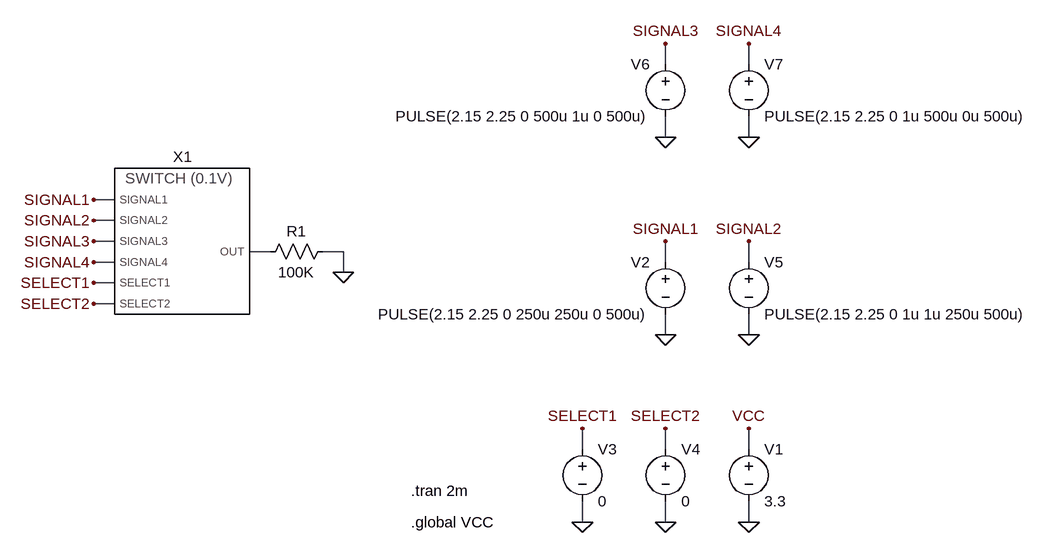
[diagram p0: schematic test_switch4_0.1v.asc]
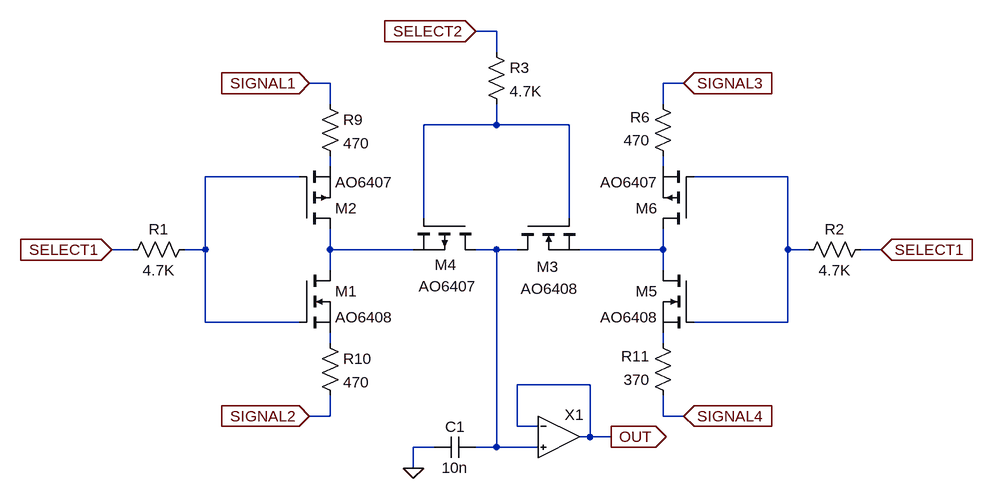
[diagram p1: sub-circuit switch4_0.1v.asc]
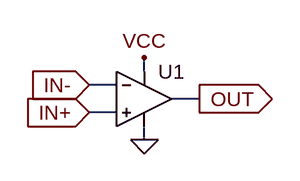
[diagram p2: sub-circuit opamp.asc]
test_switch4_0.1v.asc, the LTspice schematic file:
Version 4
SHEET 1 1908 768
WIRE 896 -64 896 -96
WIRE 1024 -64 1024 -96
WIRE 896 48 896 16
WIRE 1024 48 1024 16
WIRE 48 144 16 144
WIRE 48 176 16 176
WIRE 48 208 16 208
WIRE 288 224 256 224
WIRE 400 224 368 224
WIRE 48 240 16 240
WIRE 896 240 896 208
WIRE 1024 240 1024 208
WIRE 400 256 400 224
WIRE 48 272 16 272
WIRE 48 304 16 304
WIRE 896 352 896 320
WIRE 1024 352 1024 320
WIRE 768 528 768 496
WIRE 896 528 896 496
WIRE 1024 528 1024 496
WIRE 768 640 768 608
WIRE 896 640 896 608
WIRE 1024 640 1024 608
FLAG 400 256 0
FLAG 1024 640 0
FLAG 1024 496 VCC
FLAG 896 352 0
FLAG 896 208 SIGNAL1
FLAG 16 144 SIGNAL1
FLAG 16 176 SIGNAL2
FLAG 16 208 SIGNAL3
FLAG 16 240 SIGNAL4
FLAG 768 640 0
FLAG 768 496 SELECT1
FLAG 896 640 0
FLAG 896 496 SELECT2
FLAG 16 272 SELECT1
FLAG 16 304 SELECT2
FLAG 1024 352 0
FLAG 1024 208 SIGNAL2
FLAG 896 48 0
FLAG 896 -96 SIGNAL3
FLAG 1024 48 0
FLAG 1024 -96 SIGNAL4
SYMBOL res 384 208 R90
WINDOW 0 0 56 VBottom 2
WINDOW 3 32 56 VTop 2
SYMATTR InstName R1
SYMATTR Value 100K
SYMBOL voltage 1024 512 R0
WINDOW 123 0 0 Left 0
WINDOW 39 0 0 Left 0
SYMATTR InstName V1
SYMATTR Value 3.3
SYMBOL voltage 896 224 M0
WINDOW 123 0 0 Left 0
WINDOW 39 0 0 Left 0
SYMATTR InstName V2
SYMATTR Value PULSE(2.15 2.25 0 250u 250u 0 500u)
SYMBOL voltage 768 512 R0
WINDOW 123 0 0 Left 0
WINDOW 39 0 0 Left 0
SYMATTR InstName V3
SYMATTR Value 0
SYMBOL voltage 896 512 R0
WINDOW 123 0 0 Left 0
WINDOW 39 0 0 Left 0
SYMATTR InstName V4
SYMATTR Value 0
SYMBOL voltage 1024 224 R0
WINDOW 123 0 0 Left 0
WINDOW 39 0 0 Left 0
SYMATTR InstName V5
SYMATTR Value PULSE(2.15 2.25 0 1u 1u 250u 500u)
SYMBOL voltage 896 -80 M0
WINDOW 123 0 0 Left 0
WINDOW 39 0 0 Left 0
SYMATTR InstName V6
SYMATTR Value PULSE(2.15 2.25 0 500u 1u 0 500u)
SYMBOL voltage 1024 -80 R0
WINDOW 123 0 0 Left 0
WINDOW 39 0 0 Left 0
SYMATTR InstName V7
SYMATTR Value PULSE(2.15 2.25 0 1u 500u 0u 500u)
SYMBOL switch4_0.1v 80 144 R0
SYMATTR InstName X1
TEXT 504 592 Left 2 !.tran 2m
TEXT 504 640 Left 2 !.global VCC

switch4_0.1v.asc, the sub-circuit schematic file:
Version 4
SHEET 1 1676 680
WIRE 848 -144 816 -144
WIRE 848 -112 848 -144
WIRE 592 -64 560 -64
WIRE 1136 -64 1104 -64
WIRE 592 -32 592 -64
WIRE 1104 -32 1104 -64
WIRE 848 0 848 -32
WIRE 848 0 736 0
WIRE 960 0 848 0
WIRE 592 64 592 48
WIRE 1104 64 1104 48
WIRE 544 80 400 80
WIRE 1296 80 1152 80
WIRE 736 144 736 0
WIRE 960 144 960 0
WIRE 288 192 256 192
WIRE 400 192 400 80
WIRE 400 192 368 192
WIRE 592 192 592 160
WIRE 720 192 592 192
WIRE 848 192 816 192
WIRE 880 192 848 192
WIRE 1104 192 1104 160
WIRE 1104 192 976 192
WIRE 1296 192 1296 80
WIRE 1328 192 1296 192
WIRE 1440 192 1408 192
WIRE 592 224 592 192
WIRE 1104 224 1104 192
WIRE 400 304 400 192
WIRE 544 304 400 304
WIRE 1296 304 1296 192
WIRE 1296 304 1152 304
WIRE 592 336 592 320
WIRE 1104 336 1104 320
WIRE 992 400 880 400
WIRE 592 448 592 416
WIRE 592 448 560 448
WIRE 1104 448 1104 416
WIRE 1136 448 1104 448
WIRE 880 464 880 400
WIRE 912 464 880 464
WIRE 992 480 992 400
WIRE 992 480 976 480
WIRE 1024 480 992 480
WIRE 752 496 720 496
WIRE 848 496 848 192
WIRE 848 496 816 496
WIRE 912 496 848 496
WIRE 720 528 720 496
FLAG 560 -64 SIGNAL1
IOPIN 560 -64 In
FLAG 560 448 SIGNAL2
IOPIN 560 448 In
FLAG 256 192 SELECT1
IOPIN 256 192 In
FLAG 816 -144 SELECT2
IOPIN 816 -144 In
FLAG 1024 480 OUT
IOPIN 1024 480 Out
FLAG 720 528 0
FLAG 1136 -64 SIGNAL3
IOPIN 1136 -64 In
FLAG 1136 448 SIGNAL4
IOPIN 1136 448 In
FLAG 1440 192 SELECT1
IOPIN 1440 192 In
SYMBOL nmos 544 224 R0
SYMATTR InstName M1
SYMATTR Value AO6408
SYMBOL pmos 544 160 M180
SYMATTR InstName M2
SYMATTR Value AO6407
SYMBOL cap 816 480 R90
WINDOW 0 0 32 VBottom 2
WINDOW 3 32 32 VTop 2
SYMATTR InstName C1
SYMATTR Value 10n
SYMBOL res 576 -48 R0
SYMATTR InstName R9
SYMATTR Value 470
SYMBOL res 576 320 R0
SYMATTR InstName R10
SYMATTR Value 470
SYMBOL pmos 816 144 R90
WINDOW 0 71 63 VLeft 2
WINDOW 3 104 88 VLeft 2
SYMATTR InstName M4
SYMATTR Value AO6407
SYMBOL nmos 880 144 M90
WINDOW 0 74 30 VRight 2
WINDOW 3 108 5 VRight 2
SYMATTR InstName M3
SYMATTR Value AO6408
SYMBOL nmos 1152 224 M0
SYMATTR InstName M5
SYMATTR Value AO6408
SYMBOL pmos 1152 160 R180
SYMATTR InstName M6
SYMATTR Value AO6407
SYMBOL res 1120 64 R180
WINDOW 0 36 76 Left 2
WINDOW 3 36 40 Left 2
SYMATTR InstName R6
SYMATTR Value 470
SYMBOL res 1120 432 R180
WINDOW 0 36 76 Left 2
WINDOW 3 36 40 Left 2
SYMATTR InstName R11
SYMATTR Value 370
SYMBOL opamp 944 480 R0
WINDOW 0 9 -34 Left 2
SYMATTR InstName X1
SYMBOL res 384 176 R90
WINDOW 0 0 56 VBottom 2
WINDOW 3 32 56 VTop 2
SYMATTR InstName R1
SYMATTR Value 4.7K
SYMBOL res 1424 176 R90
WINDOW 0 0 56 VBottom 2
WINDOW 3 32 56 VTop 2
SYMATTR InstName R2
SYMATTR Value 4.7K
SYMBOL res 832 -128 R0
SYMATTR InstName R3
SYMATTR Value 4.7K

opamp.asc, the sub-circuit schematic file:
Version 4
SHEET 1 880 680
WIRE 144 144 144 128
WIRE 112 160 80 160
WIRE 208 176 176 176
WIRE 112 192 80 192
WIRE 144 224 144 208
FLAG 144 224 0
FLAG 144 128 VCC
FLAG 208 176 OUT
IOPIN 208 176 Out
FLAG 80 192 IN+
IOPIN 80 192 In
FLAG 80 160 IN-
IOPIN 80 160 In
SYMBOL Opamps\\UniversalOpamp2 144 176 R0
SYMATTR InstName U1
SYMATTR Value2 Avol=1Meg GBW=1.2Meg Slew=10Meg

The netlist it stands for:
* test_switch4_0.1v.asc
R1 0 N001 100K
V1 VCC 0 3.3
V2 SIGNAL1 0 PULSE(2.15 2.25 0 250u 250u 0 500u)
V3 SELECT1 0 0
V4 SELECT2 0 0
V5 SIGNAL2 0 PULSE(2.15 2.25 0 1u 1u 250u 500u)
V6 SIGNAL3 0 PULSE(2.15 2.25 0 500u 1u 0 500u)
V7 SIGNAL4 0 PULSE(2.15 2.25 0 1u 500u 0u 500u)
XX1 SELECT1 SIGNAL1 SIGNAL2 N001 SIGNAL3 SIGNAL4 SELECT2 switch4_0.1v

* block symbol definitions
.subckt switch4_0.1v SELECT1 SIGNAL1 SIGNAL2 OUT SIGNAL3 SIGNAL4 SELECT2
M1 N006 N004 N009 N009 AO6408
M2 N006 N004 N002 N002 AO6407
C1 N007 0 10n
R9 SIGNAL1 N002 470
R10 N009 SIGNAL2 470
M4 N007 N001 N006 N006 AO6407
M3 N007 N001 N008 N008 AO6408
M5 N008 N005 N010 N010 AO6408
M6 N008 N005 N003 N003 AO6407
R6 N003 SIGNAL3 470
R11 SIGNAL4 N010 370
XX1 N007 OUT OUT opamp
R1 N004 SELECT1 4.7K
R2 SELECT1 N005 4.7K
R3 SELECT2 N001 4.7K
.ends switch4_0.1v

.subckt opamp IN+ IN- OUT
XU1 IN+ IN- VCC 0 OUT level.2 Avol=1Meg GBW=1.2Meg Slew=10Meg ilimit=25m rail=0 Vos=0 phimargin=45 en=0 enk=0 in=0 ink=0 Rin=500Meg  ; pins IN+ IN- V+ V- OUT
.ends opamp

.model NMOS NMOS
.model PMOS PMOS
.lib standard.mos
.tran 2m
.global VCC
.lib UniversalOpamps2.sub
.backanno
.end